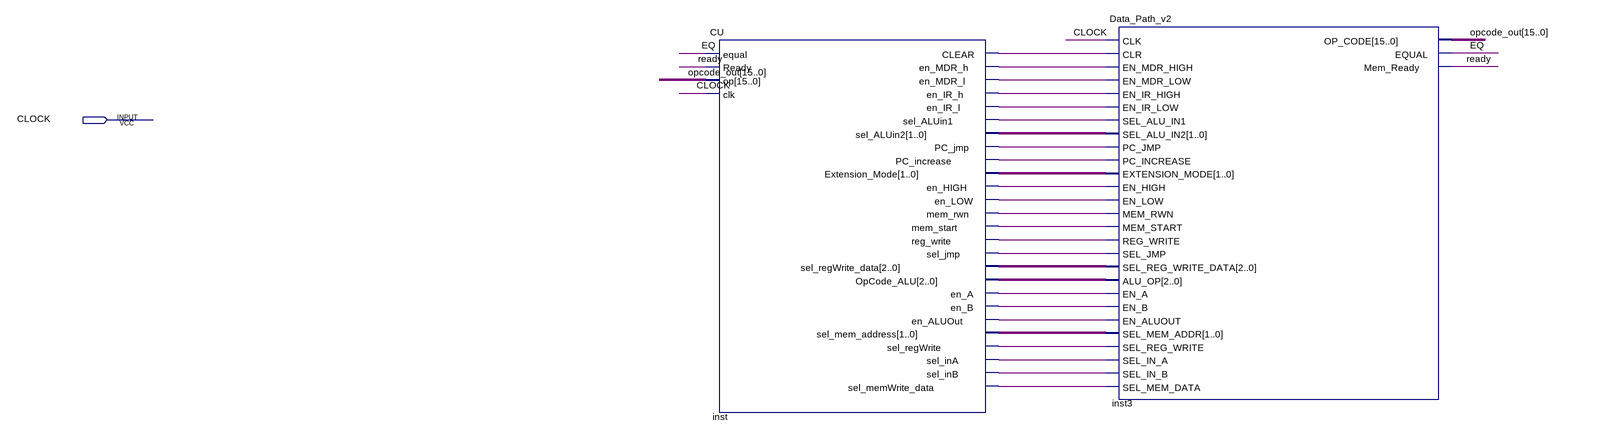
[diagram p0: schematic sheet]
// Quartus schematic Processor.bdf as structural Verilog: 2 symbols, 1 pins
module Processor (
  input  CLOCK
);

  wire EQ, inst_clear, inst_en_a, inst_en_aluout, inst_en_b, inst_en_high, inst_en_ir_h, inst_en_ir_l,
       inst_en_low, inst_en_mdr_h, inst_en_mdr_l, inst_mem_rwn, inst_mem_start, inst_pc_increase,
       inst_pc_jmp, inst_reg_write, inst_sel_aluin1, inst_sel_ina, inst_sel_inb, inst_sel_jmp,
       inst_sel_memwrite_data, inst_sel_regwrite, ready;
  wire [1:0] inst_extension_mode, inst_sel_aluin2, inst_sel_mem_address;
  wire [2:0] inst_opcode_alu, inst_sel_regwrite_data;
  wire [15:0] opcode_out;

  CU inst (
    .equal(EQ), .Ready(ready), .op(opcode_out), .clk(CLOCK), .CLEAR(inst_clear), .en_MDR_h(inst_en_mdr_h),
    .en_MDR_l(inst_en_mdr_l), .en_IR_h(inst_en_ir_h), .en_IR_l(inst_en_ir_l), .sel_ALUin1(inst_sel_aluin1),
    .sel_ALUin2(inst_sel_aluin2), .PC_jmp(inst_pc_jmp), .PC_increase(inst_pc_increase),
    .Extension_Mode(inst_extension_mode), .en_HIGH(inst_en_high), .en_LOW(inst_en_low),
    .mem_rwn(inst_mem_rwn), .mem_start(inst_mem_start), .reg_write(inst_reg_write), .sel_jmp(inst_sel_jmp),
    .sel_regWrite_data(inst_sel_regwrite_data), .OpCode_ALU(inst_opcode_alu), .en_A(inst_en_a),
    .en_B(inst_en_b), .en_ALUOut(inst_en_aluout), .sel_mem_address(inst_sel_mem_address),
    .sel_regWrite(inst_sel_regwrite), .sel_inA(inst_sel_ina), .sel_inB(inst_sel_inb),
    .sel_memWrite_data(inst_sel_memwrite_data));
  Data_Path_v2 inst3 (
    .CLK(CLOCK), .CLR(inst_clear), .EN_MDR_HIGH(inst_en_mdr_h), .EN_MDR_LOW(inst_en_mdr_l),
    .EN_IR_HIGH(inst_en_ir_h), .EN_IR_LOW(inst_en_ir_l), .SEL_ALU_IN1(inst_sel_aluin1),
    .SEL_ALU_IN2(inst_sel_aluin2), .PC_JMP(inst_pc_jmp), .PC_INCREASE(inst_pc_increase),
    .EXTENSION_MODE(inst_extension_mode), .EN_HIGH(inst_en_high), .EN_LOW(inst_en_low),
    .MEM_RWN(inst_mem_rwn), .MEM_START(inst_mem_start), .REG_WRITE(inst_reg_write), .SEL_JMP(inst_sel_jmp),
    .SEL_REG_WRITE_DATA(inst_sel_regwrite_data), .ALU_OP(inst_opcode_alu), .EN_A(inst_en_a),
    .EN_B(inst_en_b), .EN_ALUOUT(inst_en_aluout), .SEL_MEM_ADDR(inst_sel_mem_address),
    .SEL_REG_WRITE(inst_sel_regwrite), .SEL_IN_A(inst_sel_ina), .SEL_IN_B(inst_sel_inb),
    .SEL_MEM_DATA(inst_sel_memwrite_data), .OP_CODE(opcode_out), .EQUAL(EQ), .Mem_Ready(ready));
endmodule
